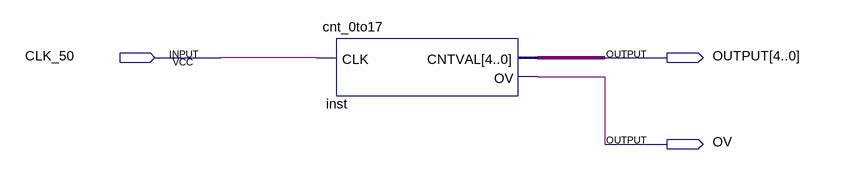
[diagram p0: schematic sheet]
// Quartus schematic start_3_1.bdf as structural Verilog: 1 symbols, 3 pins
module start_3_1 (
  input  CLK_50,
  output [4:0] OUTPUT,
  output OV
);

  cnt_0to17 inst (.CLK(CLK_50), .CNTVAL(OUTPUT), .OV(OV));
endmodule
